# EasyEDA Pro project ProProject_3rd-Chebyshev-BPF-3.5-54M-20231126_2023-11-26.epro

# Schematic Schematic1
Create Date: 2023-08-13; Page Name: P1; Project Name: 3rd-Chebyshev-BPF-1.8-30M; Schematic Name: Schematic1; Update Date: 2023-08-13; Company: 嘉立创EDA; Page Size: A4; Version: V1.0
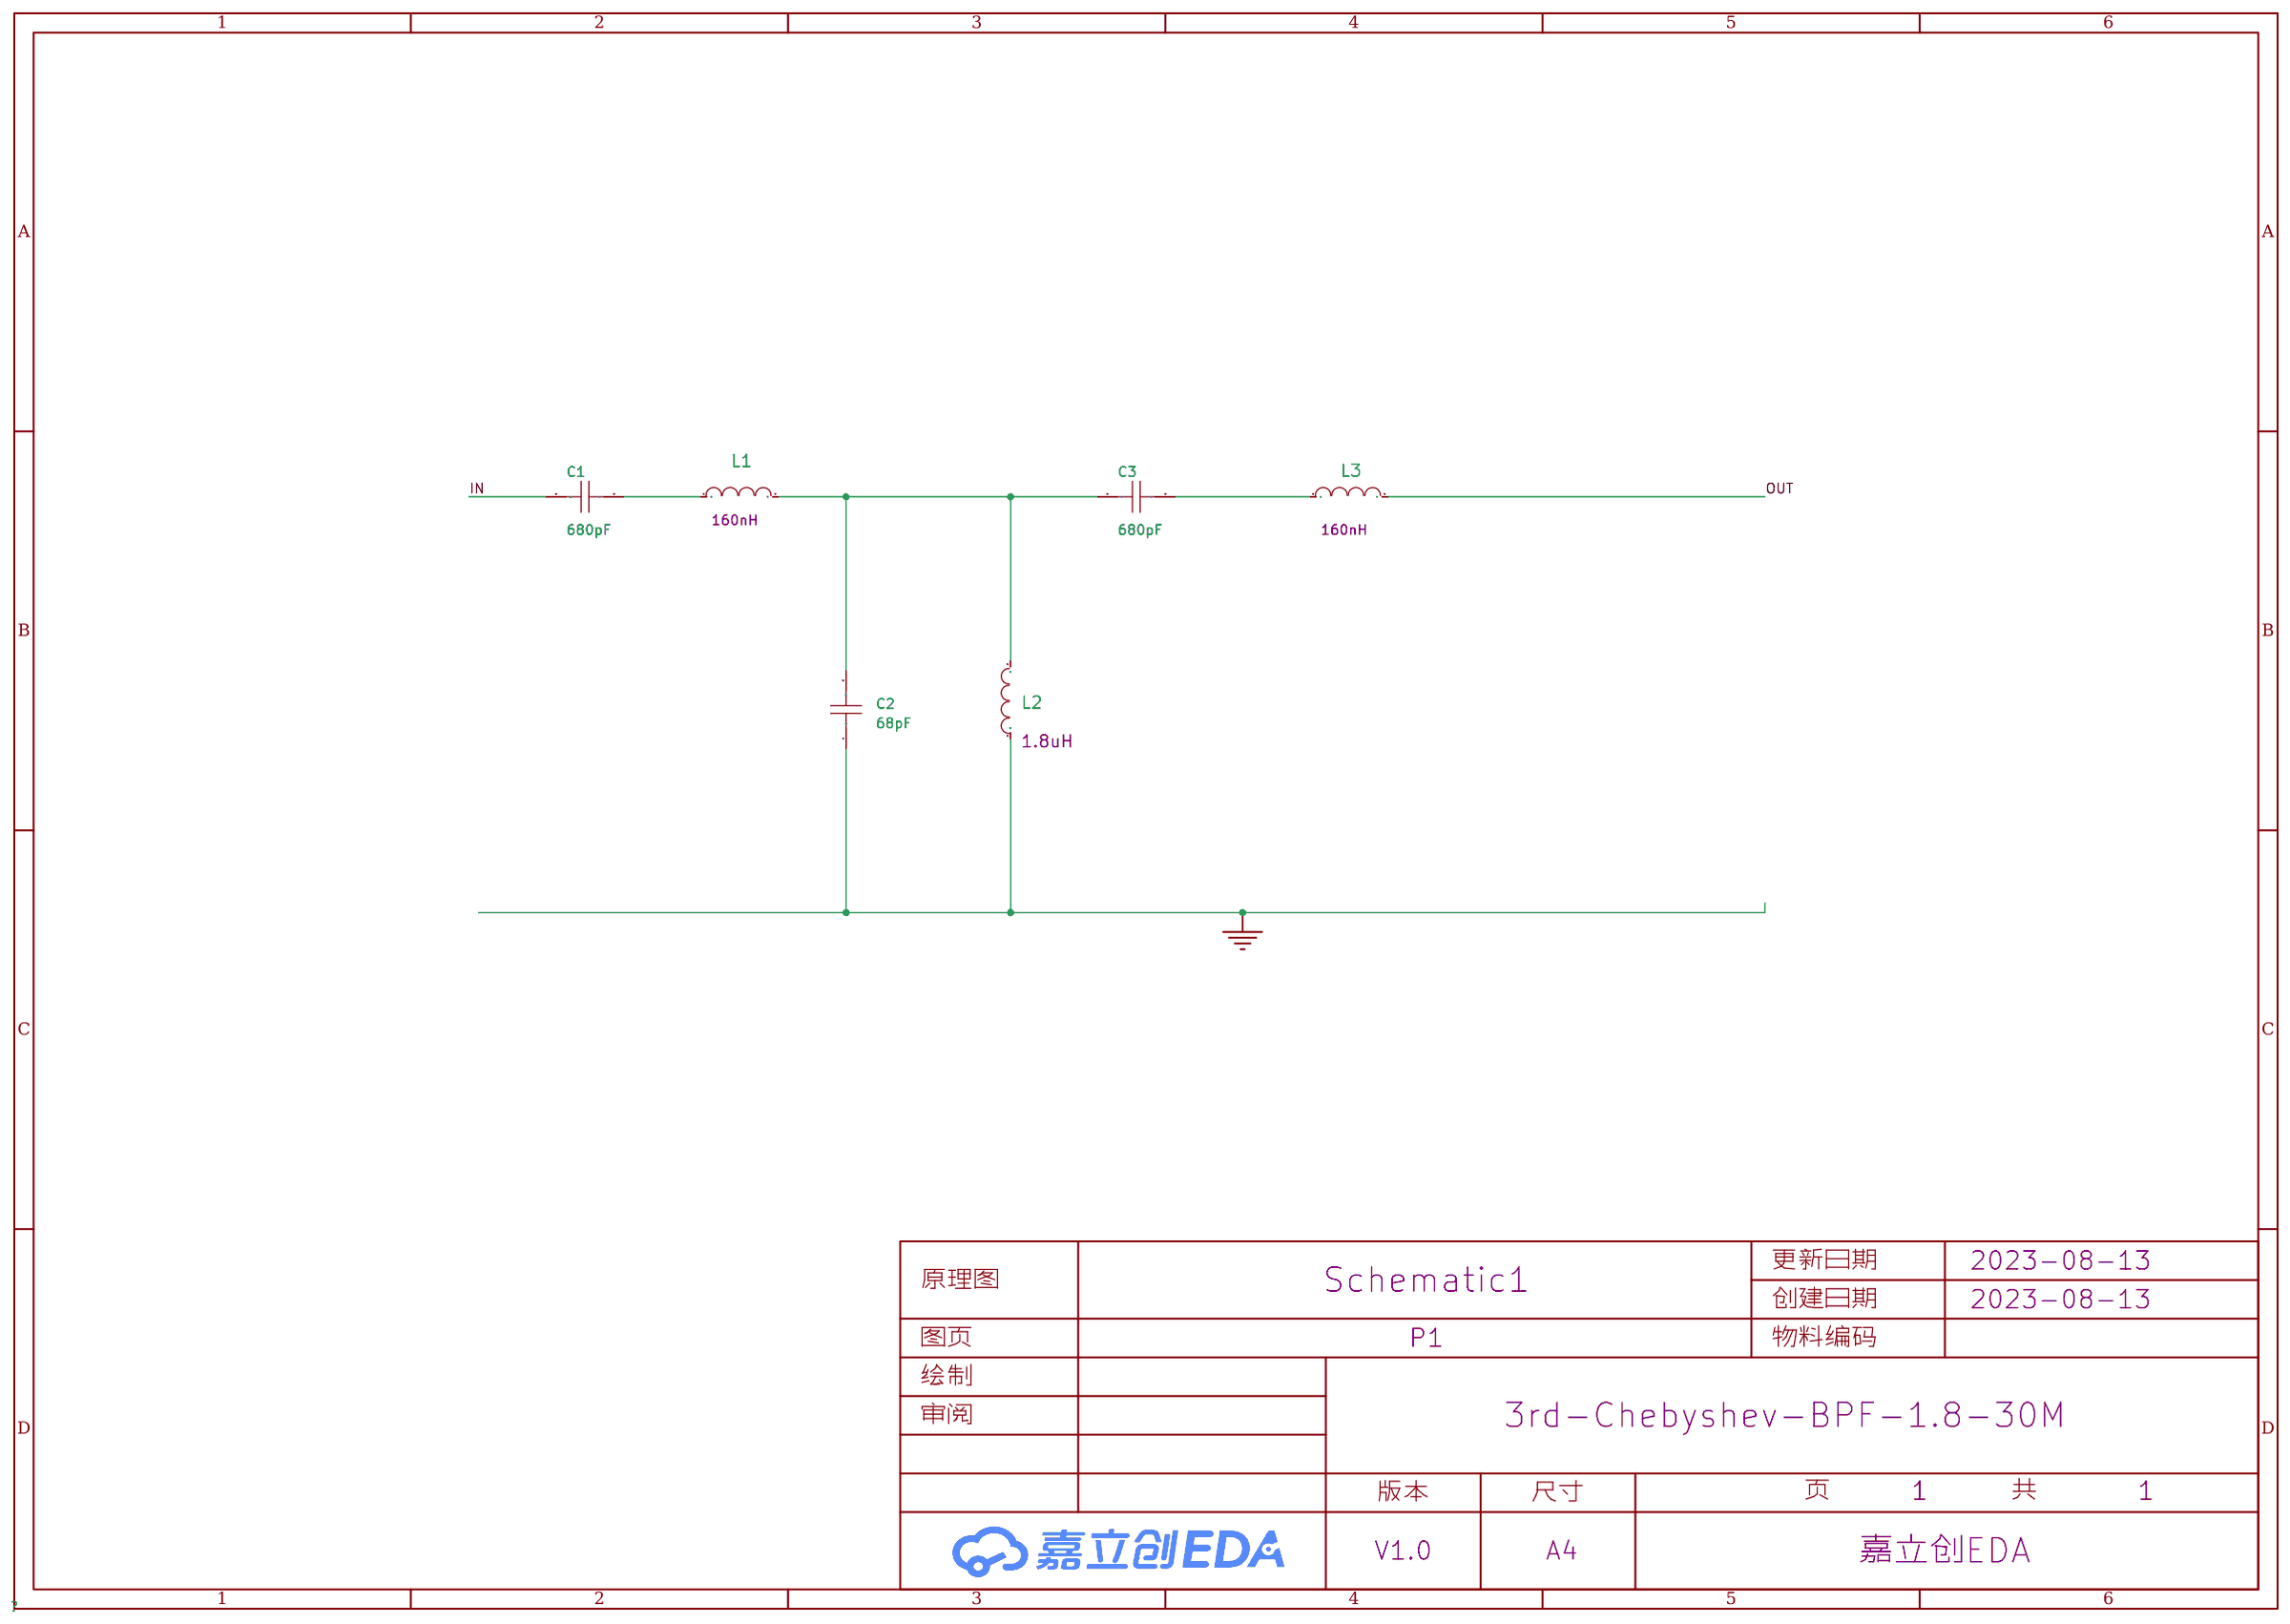
[diagram p0: schematic sheet]

## Parts
C1  680pF  [CAP-TH_L8.0-W4.0-P5.00-D1.2]
C2  68pF  [CAP-TH_L8.0-W4.0-P5.00-D1.2]
C3  680pF  [CAP-TH_L8.0-W4.0-P5.00-D1.2]
L1  -  [直插电感8mm]
L2  -  [直插电感8mm]
L3  -  [直插电感8mm]

## Library data of the parts
C1-C3 = CT81-M7Y5P1B821KSE: 容值:820pF;精度:±10%;额定电压:2kV;温度系数:Y5P;; LCSC Part Name: 820pF ±10% 2kV; Supplier Part: C305385; Manufacturer: FH(风华); Supplier Footprint: 插件,P=5mm; Datasheet: https://atta.szlcsc.com/upload/public/pdf/source/20181009/C305385_D8F730382C242B602F35CC154E07EE07.pdf; Supplier: LCSC; Tolerance: ±10%; Voltage Rated: 2kV; Lead Spacing: 5mm; Temperature Coefficient: Y5P; φD: 8mm; Body Thickness: 4mm
L1 L3 = 直插电感8mm: Inductance: 160nH
L2 = 直插电感8mm: Inductance: 1.8uH

## Nets
GND: C2.1 L2.1
IN: C1.2
OUT: L3.2
$1N347: C1.1 L1.1
$1N349: C3.1 L3.1
$1N351: C2.2 C3.2 L1.2 L2.2

# Board PCB1
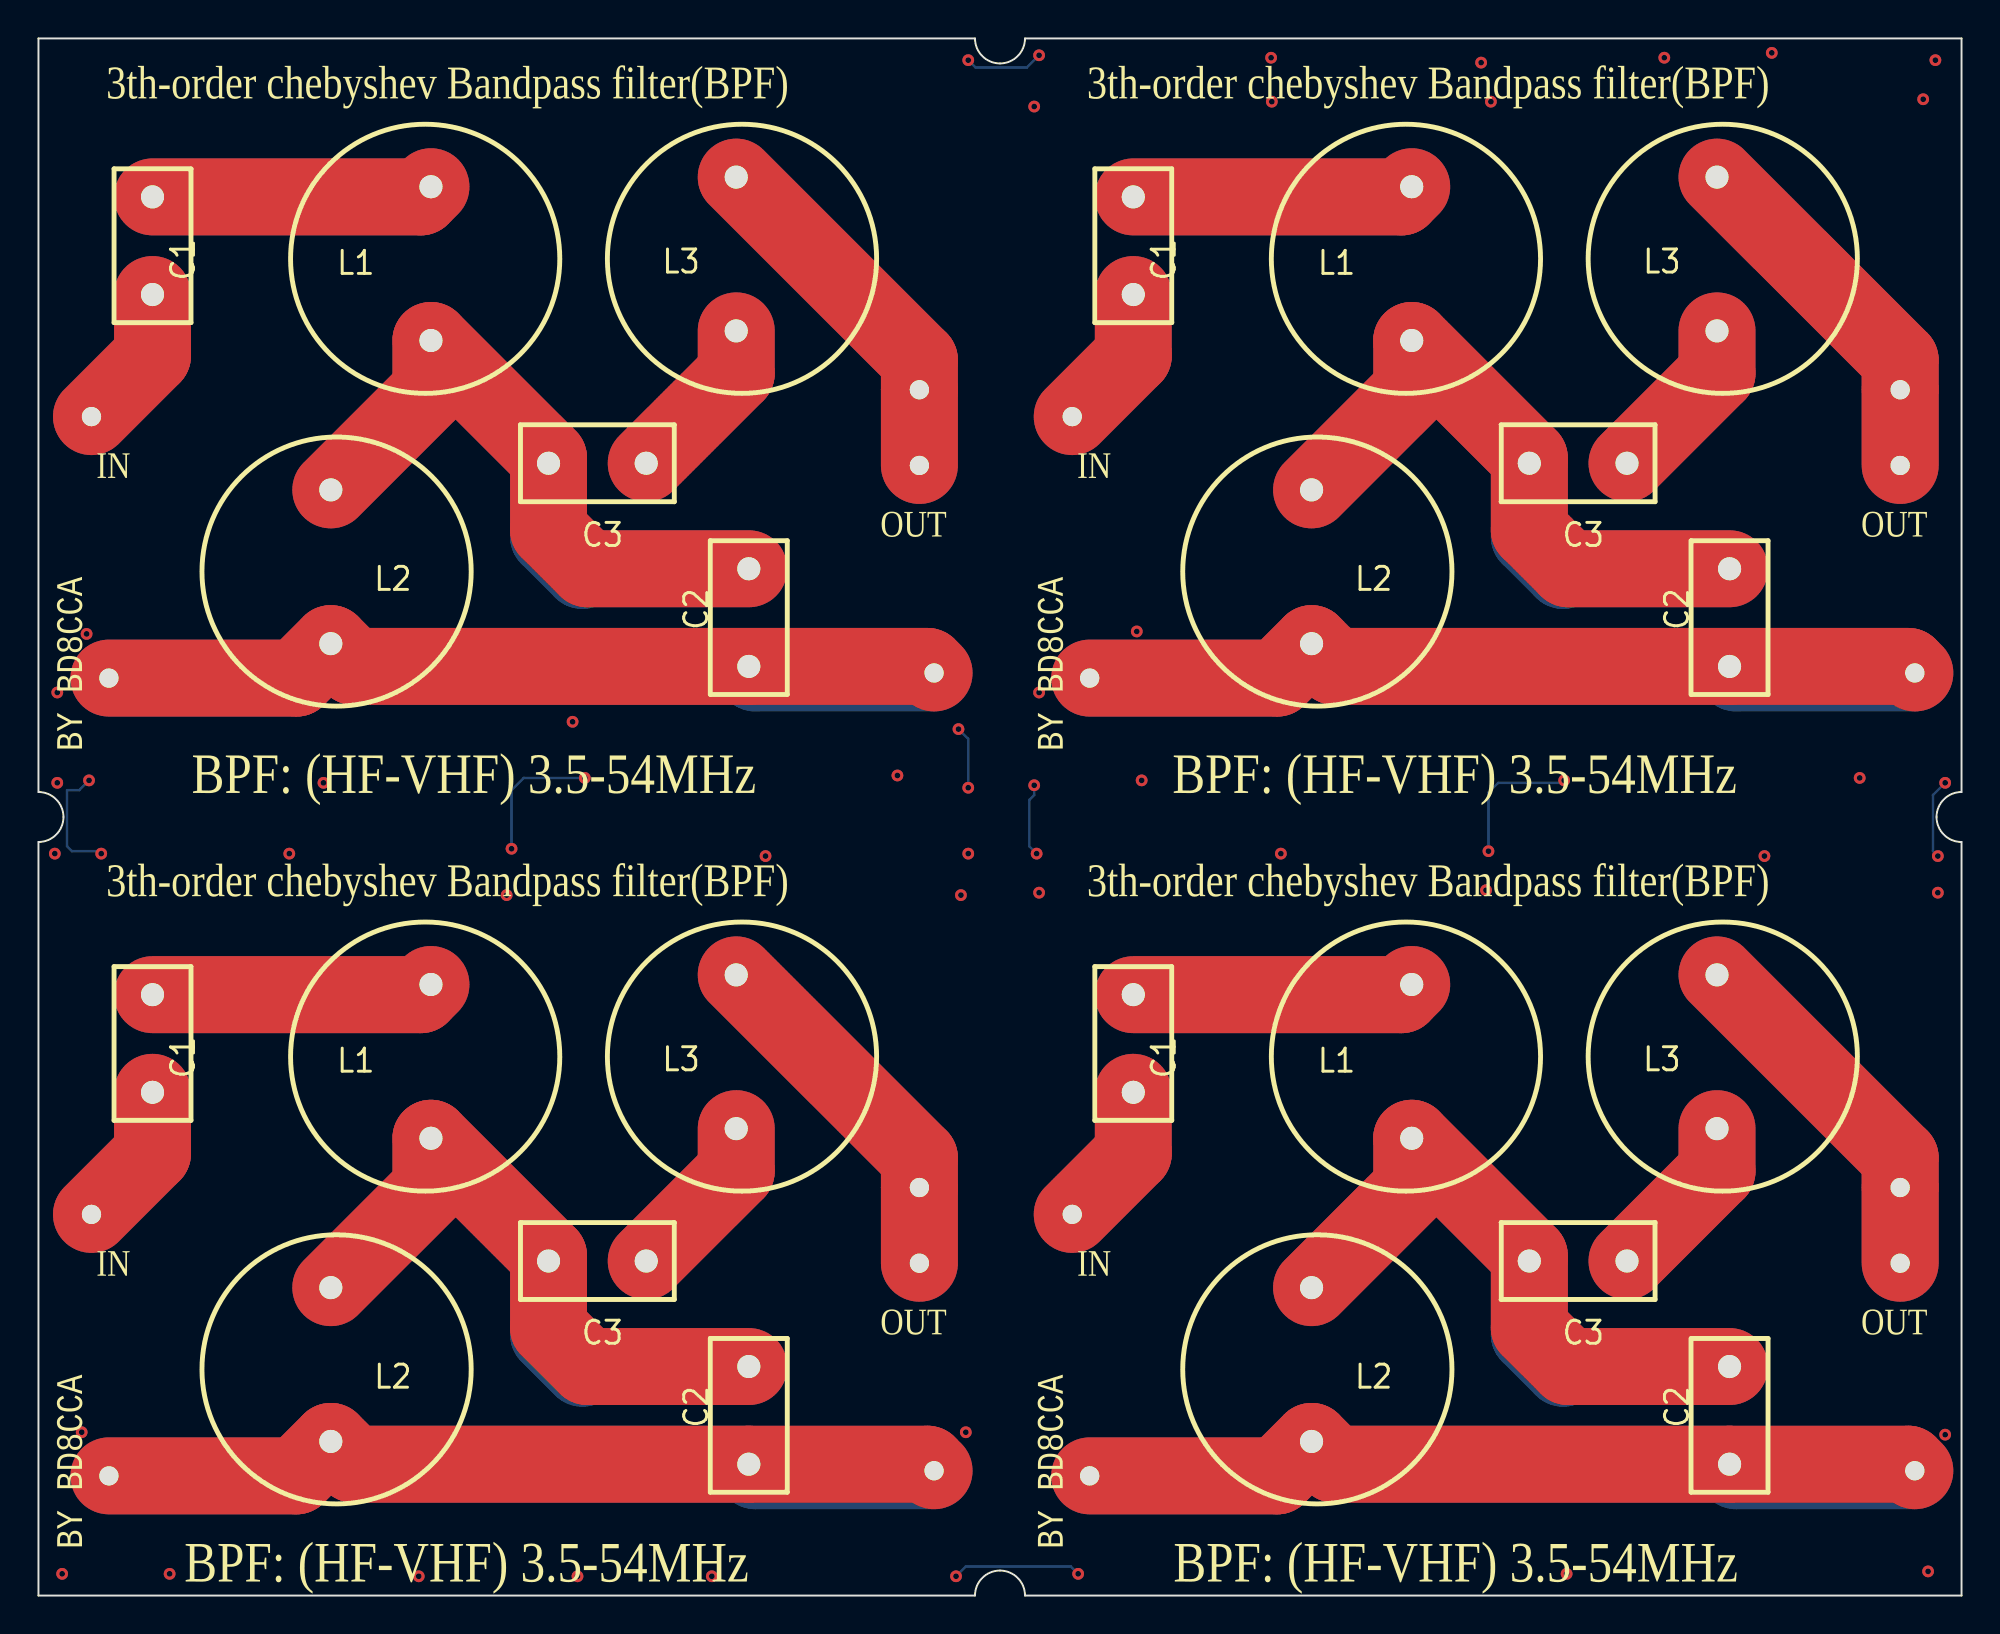
[diagram p1: board, top side]
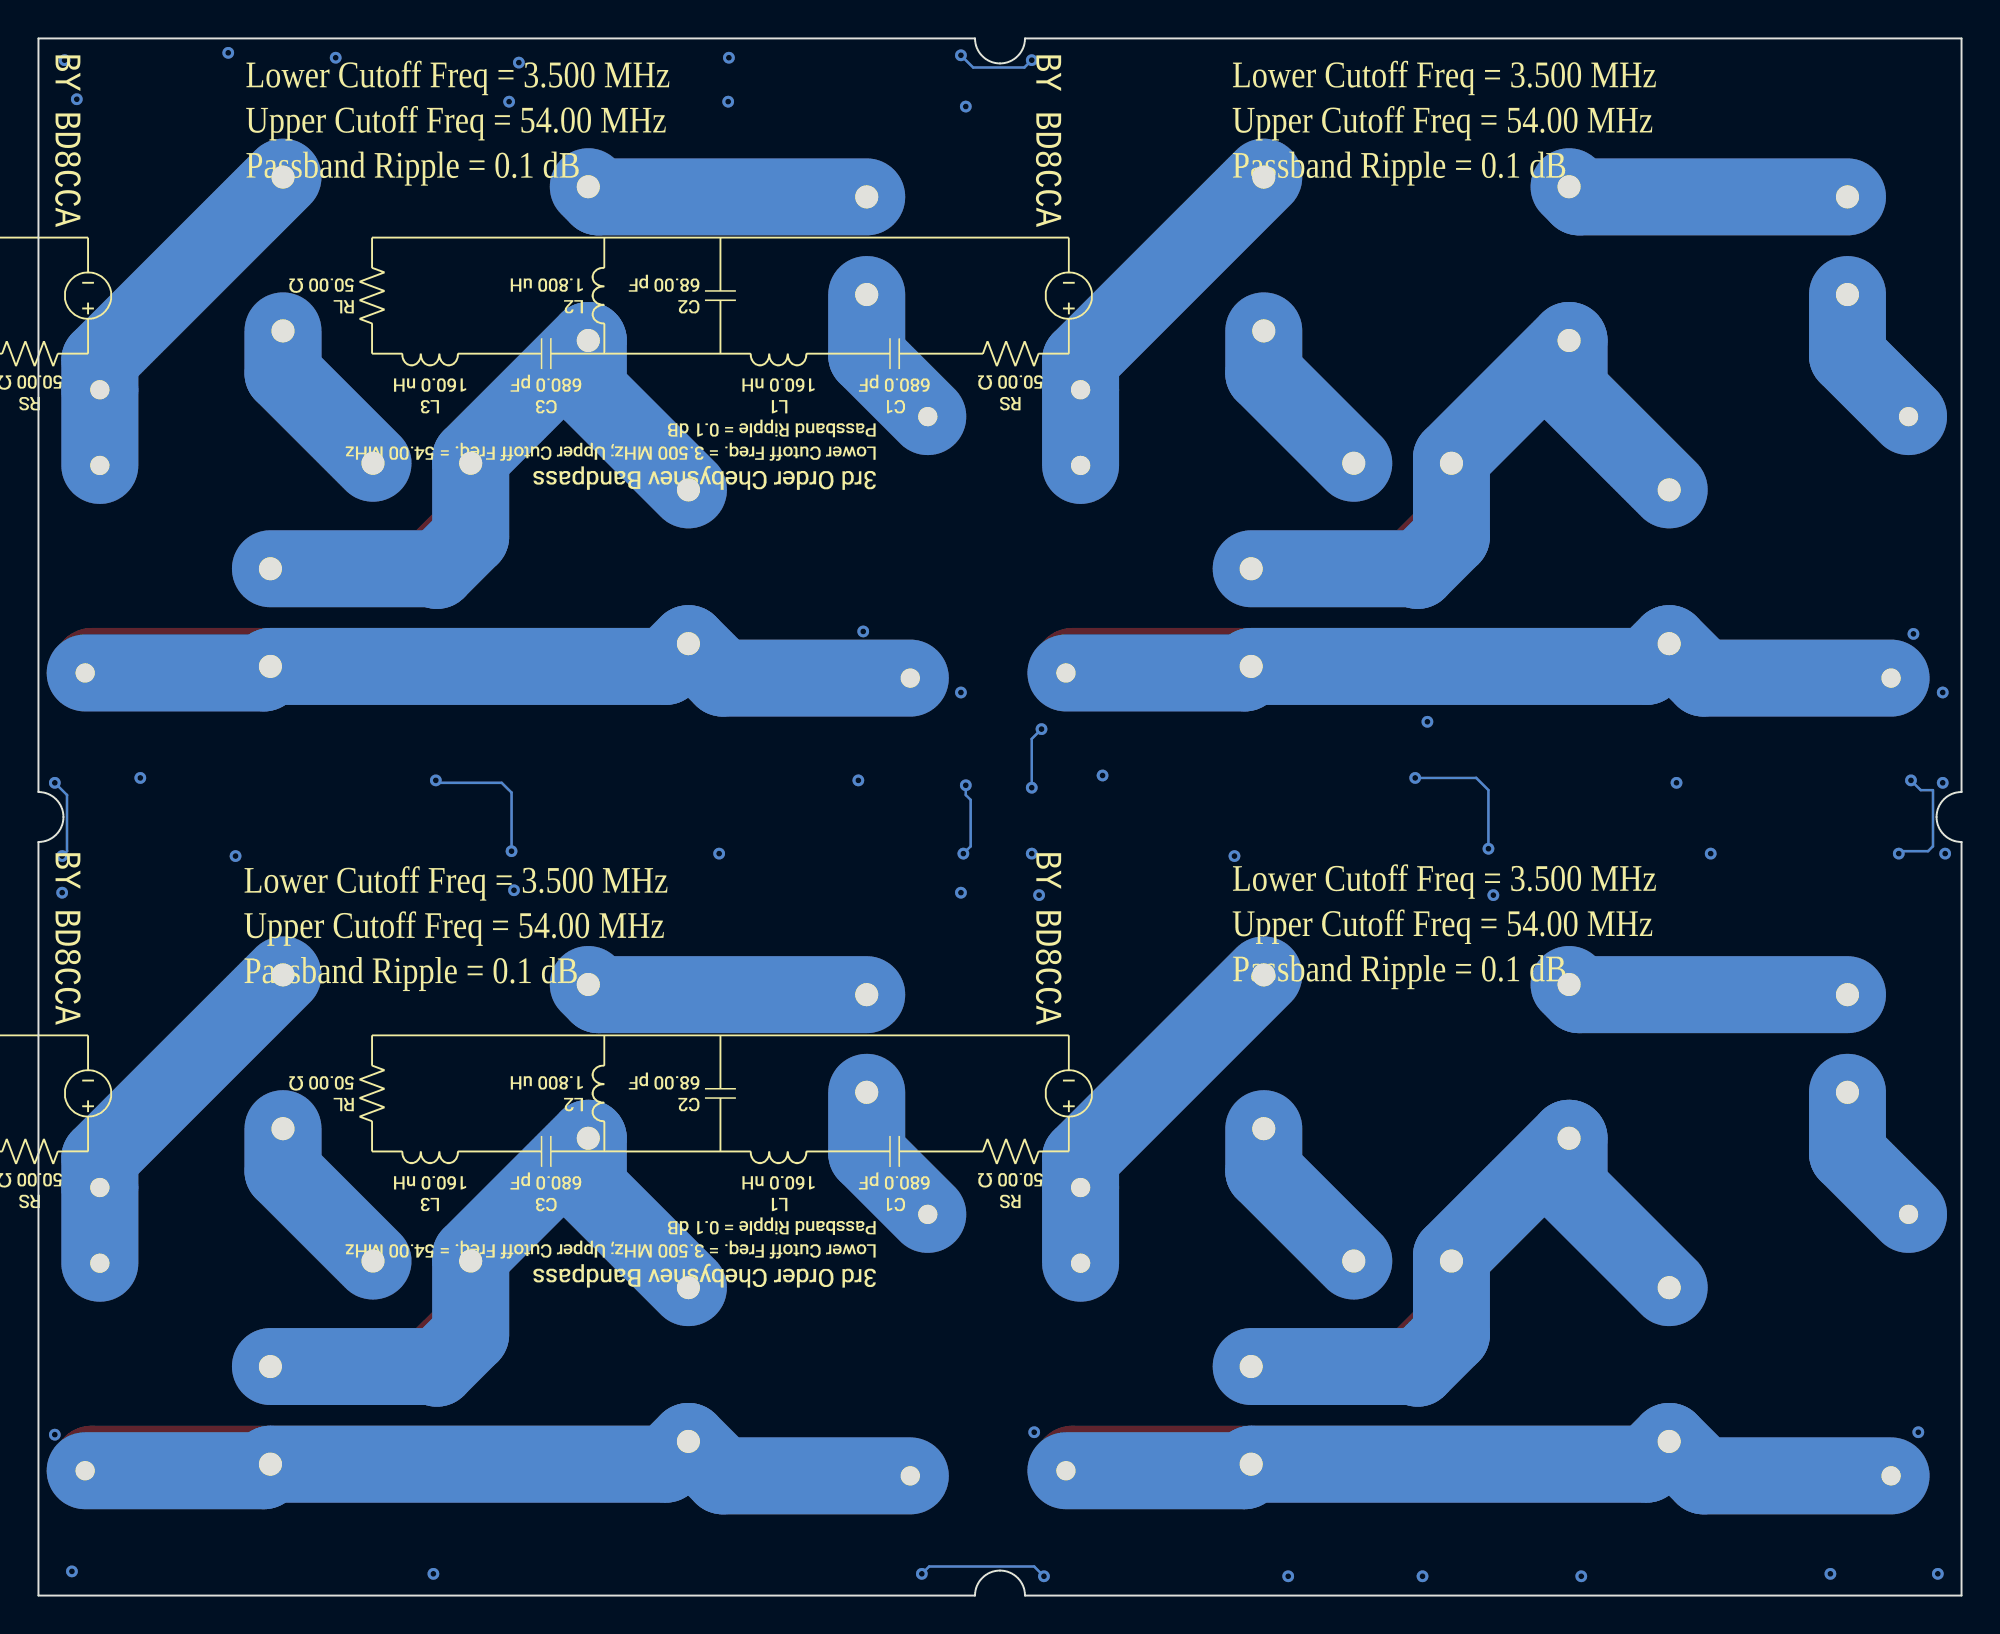
[diagram p2: board, bottom side, seen from below]

Outline 100 x 81 mm; copper layers: Top Layer, Bottom Layer. Coordinates in mm from the lower left corner of the outline.
Outline path: 0,81 48.7,81 arc(49.08,80.08) 50,79.7 arc(50.92,80.08) 51.3,81 100,81 100,41.8 arc(99.08,41.42) 98.7,40.5 arc(99.08,39.58) 100,39.2 100,0 51.3,0 arc(50.92,0.92) 50,1.3 arc(49.08,0.92) 48.7,0 0,0 0,39.2 arc(0.92,39.58) 1.3,40.5 arc(0.92,41.42) 0,41.8 0,81
Stack: Top Layer 0.035mm / Dielectric1 1.51mm FR4 er 4.5 / Bottom Layer 0.035mm

## Design rules (mm)
template: 自定义配置
spacing copperThickness1oz (default): track to track 0.102, other pairs 0.152 to 0.3
spacing copperThickness2oz: track to track 0.203, other pairs 0.152 to 0.3
track width copperThickness1oz (default): min 0.127, default 3, max 5
track width copperThickness2oz: min 0.203, default 0.254, max 2.54
differential pair differentialPair (default): width min 0.127, default 0.254, max 2.54; gap min 0.152, default 0.152
via viaSize (default): diameter min 0.5, default 0.61, max 10; hole min 0.3, default 0.305, max 6.3

## Placement (name value [footprint] x y rotation side)
C1  680pF  [CAP-TH_L8.0-W4.0-P5.00-D1.2]  5.93 70.22 270 top
C1#2  -  [CAP-TH_L8.0-W4.0-P5.00-D1.2]  56.93 70.22 270 top
C1#3  -  [CAP-TH_L8.0-W4.0-P5.00-D1.2]  5.93 28.72 270 top
C1#4  -  [CAP-TH_L8.0-W4.0-P5.00-D1.2]  56.93 28.72 270 top
C2  68pF  [CAP-TH_L8.0-W4.0-P5.00-D1.2]  36.94 50.87 90 top
C2#2  -  [CAP-TH_L8.0-W4.0-P5.00-D1.2]  87.94 50.87 90 top
C2#3  -  [CAP-TH_L8.0-W4.0-P5.00-D1.2]  36.94 9.37 90 top
C2#4  -  [CAP-TH_L8.0-W4.0-P5.00-D1.2]  87.94 9.37 90 top
C3  680pF  [CAP-TH_L8.0-W4.0-P5.00-D1.2]  29.06 58.9 180 top
C3#2  -  [CAP-TH_L8.0-W4.0-P5.00-D1.2]  80.06 58.9 180 top
C3#3  -  [CAP-TH_L8.0-W4.0-P5.00-D1.2]  29.06 17.4 180 top
C3#4  -  [CAP-TH_L8.0-W4.0-P5.00-D1.2]  80.06 17.4 180 top
L1  -  [直插电感8mm]  20.41 73.29 270 top
L1#2  -  [直插电感8mm]  71.41 73.29 270 top
L1#3  -  [直插电感8mm]  20.41 31.79 270 top
L1#4  -  [直插电感8mm]  71.41 31.79 270 top
L2  -  [直插电感8mm]  15.2 49.52 90 top
L2#2  -  [直插电感8mm]  66.2 49.52 90 top
L2#3  -  [直插电感8mm]  15.2 8.02 90 top
L2#4  -  [直插电感8mm]  66.2 8.02 90 top
L3  -  [直插电感8mm]  36.28 65.79 90 top
L3#2  -  [直插电感8mm]  87.28 65.79 90 top
L3#3  -  [直插电感8mm]  36.28 24.29 90 top
L3#4  -  [直插电感8mm]  87.28 24.29 90 top
NOREF  -  [Pad_e805]  54.66 6.23 0 top
NOREF#2  -  [Pad_e716]  2.76 19.83 0 top
NOREF#3  -  [Pad_e707]  45.81 17.29 0 top
NOREF#4  -  [Pad_e883]  96.81 17.29 0 top
NOREF#5  -  [Pad_e541]  54.66 47.73 0 top
NOREF#6  -  [Pad_e705]  45.81 21.23 0 top
NOREF#7  -  [Pad_e121]  45.81 58.79 0 top
NOREF#8  -  [Pad_e619]  96.81 58.79 0 top
NOREF#9  -  [Pad_e138]  46.57 47.99 0 top
NOREF#10  -  [Pad_e713]  46.57 6.49 0 top
NOREF#11  -  [Pad_e617]  96.81 62.73 0 top
NOREF#12  -  [Pad_e629]  3.66 6.23 0 top
NOREF#13  -  [Pad_e892]  53.76 19.83 0 top
NOREF#14  -  [Pad_e881]  96.81 21.23 0 top
NOREF#15  -  [Pad_e628]  53.76 61.33 0 top
NOREF#16  -  [Pad_e889]  97.57 6.49 0 top
NOREF#17  -  [Pad_e226]  2.76 61.33 0 top
NOREF#18  -  [Pad_e625]  97.57 47.99 0 top
NOREF#19  -  [Pad_e141]  45.81 62.73 0 top
NOREF#20  -  [Pad_e225]  3.66 47.73 0 top

## Footprints (pads in the part's own frame, mm; a bottom-side part is the same pattern mirrored in y, then rotated)
CAP-TH_L8.0-W4.0-P5.00-D1.2
  round 1.8 hole 1.2: 1(-2.54,0) 2(2.54,0)
Pad_e121
  round 2 hole 1: 3(0,0)
Pad_e138
  round 2 hole 1: 4(0,0)
Pad_e141
  round 2 hole 1: 3(0,0)
Pad_e225
  round 2 hole 1: 4(0,0)
Pad_e226
  round 2 hole 1: 3(0,0)
Pad_e541
  round 2 hole 1: 4(0,0)
Pad_e617
  round 2 hole 1: 3(0,0)
Pad_e619
  round 2 hole 1: 3(0,0)
Pad_e625
  round 2 hole 1: 4(0,0)
Pad_e628
  round 2 hole 1: 3(0,0)
Pad_e629
  round 2 hole 1: 4(0,0)
Pad_e705
  round 2 hole 1: 3(0,0)
Pad_e707
  round 2 hole 1: 3(0,0)
Pad_e713
  round 2 hole 1: 4(0,0)
Pad_e716
  round 2 hole 1: 3(0,0)
Pad_e805
  round 2 hole 1: 4(0,0)
Pad_e881
  round 2 hole 1: 3(0,0)
Pad_e883
  round 2 hole 1: 3(0,0)
Pad_e889
  round 2 hole 1: 4(0,0)
Pad_e892
  round 2 hole 1: 3(0,0)
直插电感8mm
  round 2 hole 1.2: 1(0,0) 2(8,0)

## Nets
GND: C2.1 C2#2.1 C2#3.1 C2#4.1 L2.1 L2#2.1 L2#3.1 L2#4.1 NOREF.4 NOREF#5.4 NOREF#9.4 NOREF#10.4 NOREF#12.4 NOREF#16.4 NOREF#18.4 NOREF#20.4
IN: C1.2 C1#2.2 C1#3.2 C1#4.2 NOREF#2.3 NOREF#13.3 NOREF#15.3 NOREF#17.3
OUT: L3.2 L3#2.2 L3#3.2 L3#4.2 NOREF#3.3 NOREF#4.3 NOREF#6.3 NOREF#7.3 NOREF#8.3 NOREF#11.3 NOREF#14.3 NOREF#19.3
$1N347: C1.1 C1#2.1 C1#3.1 C1#4.1 L1.1 L1#2.1 L1#3.1 L1#4.1
$1N349: C3.1 C3#2.1 C3#3.1 C3#4.1 L3.1 L3#2.1 L3#3.1 L3#4.1
$1N351: C2.2 C2#2.2 C2#3.2 C2#4.2 C3.2 C3#2.2 C3#3.2 C3#4.2 L1.2 L1#2.2 L1#3.2 L1#4.2 L2.2 L2#2.2 L2#3.2 L2#4.2

## Via types
v1: diameter 0.61, hole 0.305, Top Layer to Bottom Layer, 56 vias

## Routing (per net, layer and track width the routed paths; a pad name or vN(x,y) marks a point on that pad's centre or on a via; arc(x,y) is an arc through that point)
GND: length 396.9
  Top Layer w4: NOREF#5.4 64.41,47.73 L2#2.1 67.39,48.33 C2#2.1 97.23,48.33 NOREF#18.4 ; NOREF#16.4 97.23,6.83 C2#4.1 67.39,6.83 L2#4.1 64.41,6.23 NOREF.4 ; NOREF#20.4 13.41,47.73 L2.1 16.39,48.33 C2.1 46.23,48.33 NOREF#9.4 ; NOREF#10.4 46.23,6.83 C2#3.1 16.39,6.83 L2#3.1 13.41,6.23 NOREF#12.4
  Bottom Layer w0.127: v1(54.06,1.13) 53.68,1.51 48.22,1.51 v1(47.71,1) ; v1(98.77,38.47) 98.51,38.72 98.51,41.64 v1(99.15,42.28) ; v1(79.34,42.41) 79.21,42.28 75.91,42.28 75.4,41.77 v1(75.4,38.72) ; v1(3.26,38.6) 3.14,38.72 1.74,38.72 1.49,38.98 1.49,41.9 2.12,41.9 v1(2.63,42.41) ; v1(51.91,38.6) 51.52,38.98 51.52,41.39 51.78,41.64 v1(51.78,42.15) ; v1(48.35,42.02) 48.35,44.56 v1(47.84,45.07) ; v1(52.03,80.12) 51.4,79.49 48.73,79.49 v1(48.35,79.87) ; v1(28.41,42.53) 25.23,42.53 24.6,41.9 v1(24.6,38.85)
  Bottom Layer w4: NOREF.4 64.41,6.23 L2#4.1 67.39,6.83 C2#4.1 88.28,6.49 NOREF#16.4 ; NOREF#9.4 37.28,47.99 C2.1 16.39,48.33 L2.1 13.41,47.73 NOREF#20.4 ; NOREF#5.4 64.41,47.73 L2#2.1 67.39,48.33 C2#2.1 88.28,47.99 NOREF#18.4 ; NOREF#12.4 13.41,6.23 L2#3.1 16.39,6.83 C2#3.1 37.28,6.49 NOREF#10.4
  vias: v1(0.85,38.6) v1(0.98,46.98) v1(0.98,42.28) v1(1.23,1.13) v1(2.25,8.5) v1(2.5,50.03) v1(6.82,1.13) v1(13.04,38.6) v1(14.82,42.28) v1(19.77,1) v1(24.35,36.44) v1(27.78,45.45) v1(28.03,1) v1(35.01,1) v1(37.81,38.47) v1(44.67,42.66) v1(47.97,36.44) v1(48.22,8.5) v1(48.35,38.6) v1(51.78,77.46) v1(52.03,46.98) v1(52.03,36.56) v1(57.11,50.15) v1(57.37,42.41) v1(64.1,80) v1(64.13,77.71) v1(64.61,38.6) v1(75.02,79.74) v1(75.27,36.69) v1(75.53,77.71) v1(79.46,1.13) v1(84.54,80) v1(89.75,38.47) v1(90.13,80.25) v1(94.7,42.53) v1(98.01,77.84) v1(98.26,1.26) v1(98.64,79.87) v1(98.77,36.56) v1(99.15,8.37)
IN: length 61.3
  Top Layer w4: C1#2.2 56.93,64.5 NOREF#15.3 ; NOREF#13.3 56.93,23 C1#4.2 ; C1.2 5.93,64.5 NOREF#17.3 ; C1#3.2 5.93,23 NOREF#2.3
  Bottom Layer w4: C1.2 5.93,64.5 NOREF#17.3 ; C1#2.2 56.93,64.5 NOREF#15.3 ; NOREF#13.3 56.93,23 C1#4.2 ; C1#3.2 5.93,23 NOREF#2.3
OUT: length 151.6
  Top Layer w4: NOREF#4.3 NOREF#14.3 96.81,22.76 L3#4.2 ; L3#2.2 96.81,64.26 NOREF#11.3 NOREF#8.3 ; NOREF#3.3 NOREF#6.3 45.81,22.76 L3#3.2 ; NOREF#7.3 NOREF#19.3 45.81,64.26 L3.2
  Bottom Layer w4: NOREF#8.3 NOREF#11.3 96.81,64.26 L3#2.2 ; NOREF#7.3 NOREF#19.3 45.81,64.26 L3.2 ; L3#4.2 96.81,22.76 NOREF#14.3 NOREF#4.3 ; NOREF#3.3 NOREF#6.3 45.81,22.76 L3#3.2
$1N347: length 117.6
  Top Layer w4: L1.1 19.88,72.76 C1.1 ; C1#3.1 19.88,31.26 L1#3.1 ; L1#2.1 70.88,72.76 C1#2.1 ; C1#4.1 70.88,31.26 L1#4.1
  Bottom Layer w4: C1#2.1 70.88,72.76 L1#2.1 ; L1#3.1 19.88,31.26 C1#3.1 ; C1.1 19.88,72.76 L1.1 ; C1#4.1 70.88,31.26 L1#4.1
$1N349: length 70.6
  Top Layer w4: C3#4.1 87.28,22.08 L3#4.1 ; L3#2.1 87.28,63.58 C3#2.1 ; L3.1 36.28,63.58 C3.1 ; L3#3.1 36.28,22.08 C3#3.1
  Bottom Layer w4: L3#4.1 87.28,22.08 C3#4.1 ; L3.1 36.28,63.58 C3.1 ; L3#3.1 36.28,22.08 C3#3.1 ; C3#2.1 87.28,63.58 L3#2.1
$1N351: length 269.6
  Top Layer w4: L2#4.2 71.41,21.22 L1#4.2 77.52,17.67 C3#4.2 77.52,13.93 79.54,11.91 C2#4.2 ; L2.2 20.41,62.72 L1.2 26.52,59.17 C3.2 26.52,55.43 28.54,53.41 C2.2 ; C2#2.2 79.54,53.41 77.52,55.43 C3#2.2 77.52,59.17 L1#2.2 71.41,62.72 L2#2.2 ; L2#3.2 20.41,21.22 L1#3.2 26.52,17.67 C3#3.2 26.52,13.93 28.54,11.91 C2#3.2
  Bottom Layer w4: L2#4.2 71.41,21.22 L1#4.2 77.52,17.67 C3#4.2 77.52,13.59 79.28,11.83 79.37,11.91 C2#4.2 ; C2.2 28.37,53.41 28.28,53.33 26.52,55.09 C3.2 26.52,59.17 L1.2 20.41,62.72 L2.2 ; L2#2.2 71.41,62.72 L1#2.2 77.52,59.17 C3#2.2 77.52,55.09 79.28,53.33 79.37,53.41 C2#2.2 ; C2#3.2 28.37,11.91 28.28,11.83 26.52,13.59 C3#3.2 26.52,17.67 L1#3.2 20.41,21.22 L2#3.2

## Copper pours and planes (outline as drawn; the poured copper is in the pictures)
GND on Top Layer: -1.05,9 12.41,9 14.19,10.78 16.34,10.78 17.74,9.39 17.74,9 62.7,9 62.95,8.75 64.86,10.66 64.86,10.91 67.15,10.91 68.8,9.26 68.8,9 101.56,9 102.07,8.5 102.07,-5.98 -0.8,-5.98 -1.05,-6.24
GND on Top Layer: -0.8,50.66 12.66,50.66 14.44,52.44 16.6,52.44 18,51.04 18,50.66 62.95,50.66 63.21,50.41 65.11,52.31 65.11,52.57 67.4,52.57 69.05,50.91 69.05,50.66 101.82,50.66 102.32,50.15 102.32,35.67 -0.55,35.67 -0.8,35.42
GND on Top Layer: -3.47,84.7 104.1,84.7 104.1,76.82 -3.47,76.82

## Text on the board
Bottom Silkscreen Layer: BY BD8CCA | Lower Cutoff Freq = 3.500 MHz / Upper Cutoff Freq = 54.00 MHz / Passband Ripple = 0.1 dB
Top Silkscreen Layer: BY BD8CCA | IN | OUT | 3th-order chebyshev Bandpass filter(BPF) | BPF: (HF-VHF) 3.5-54MHz
